# Altium project Sensy_Boi.PrjPcb
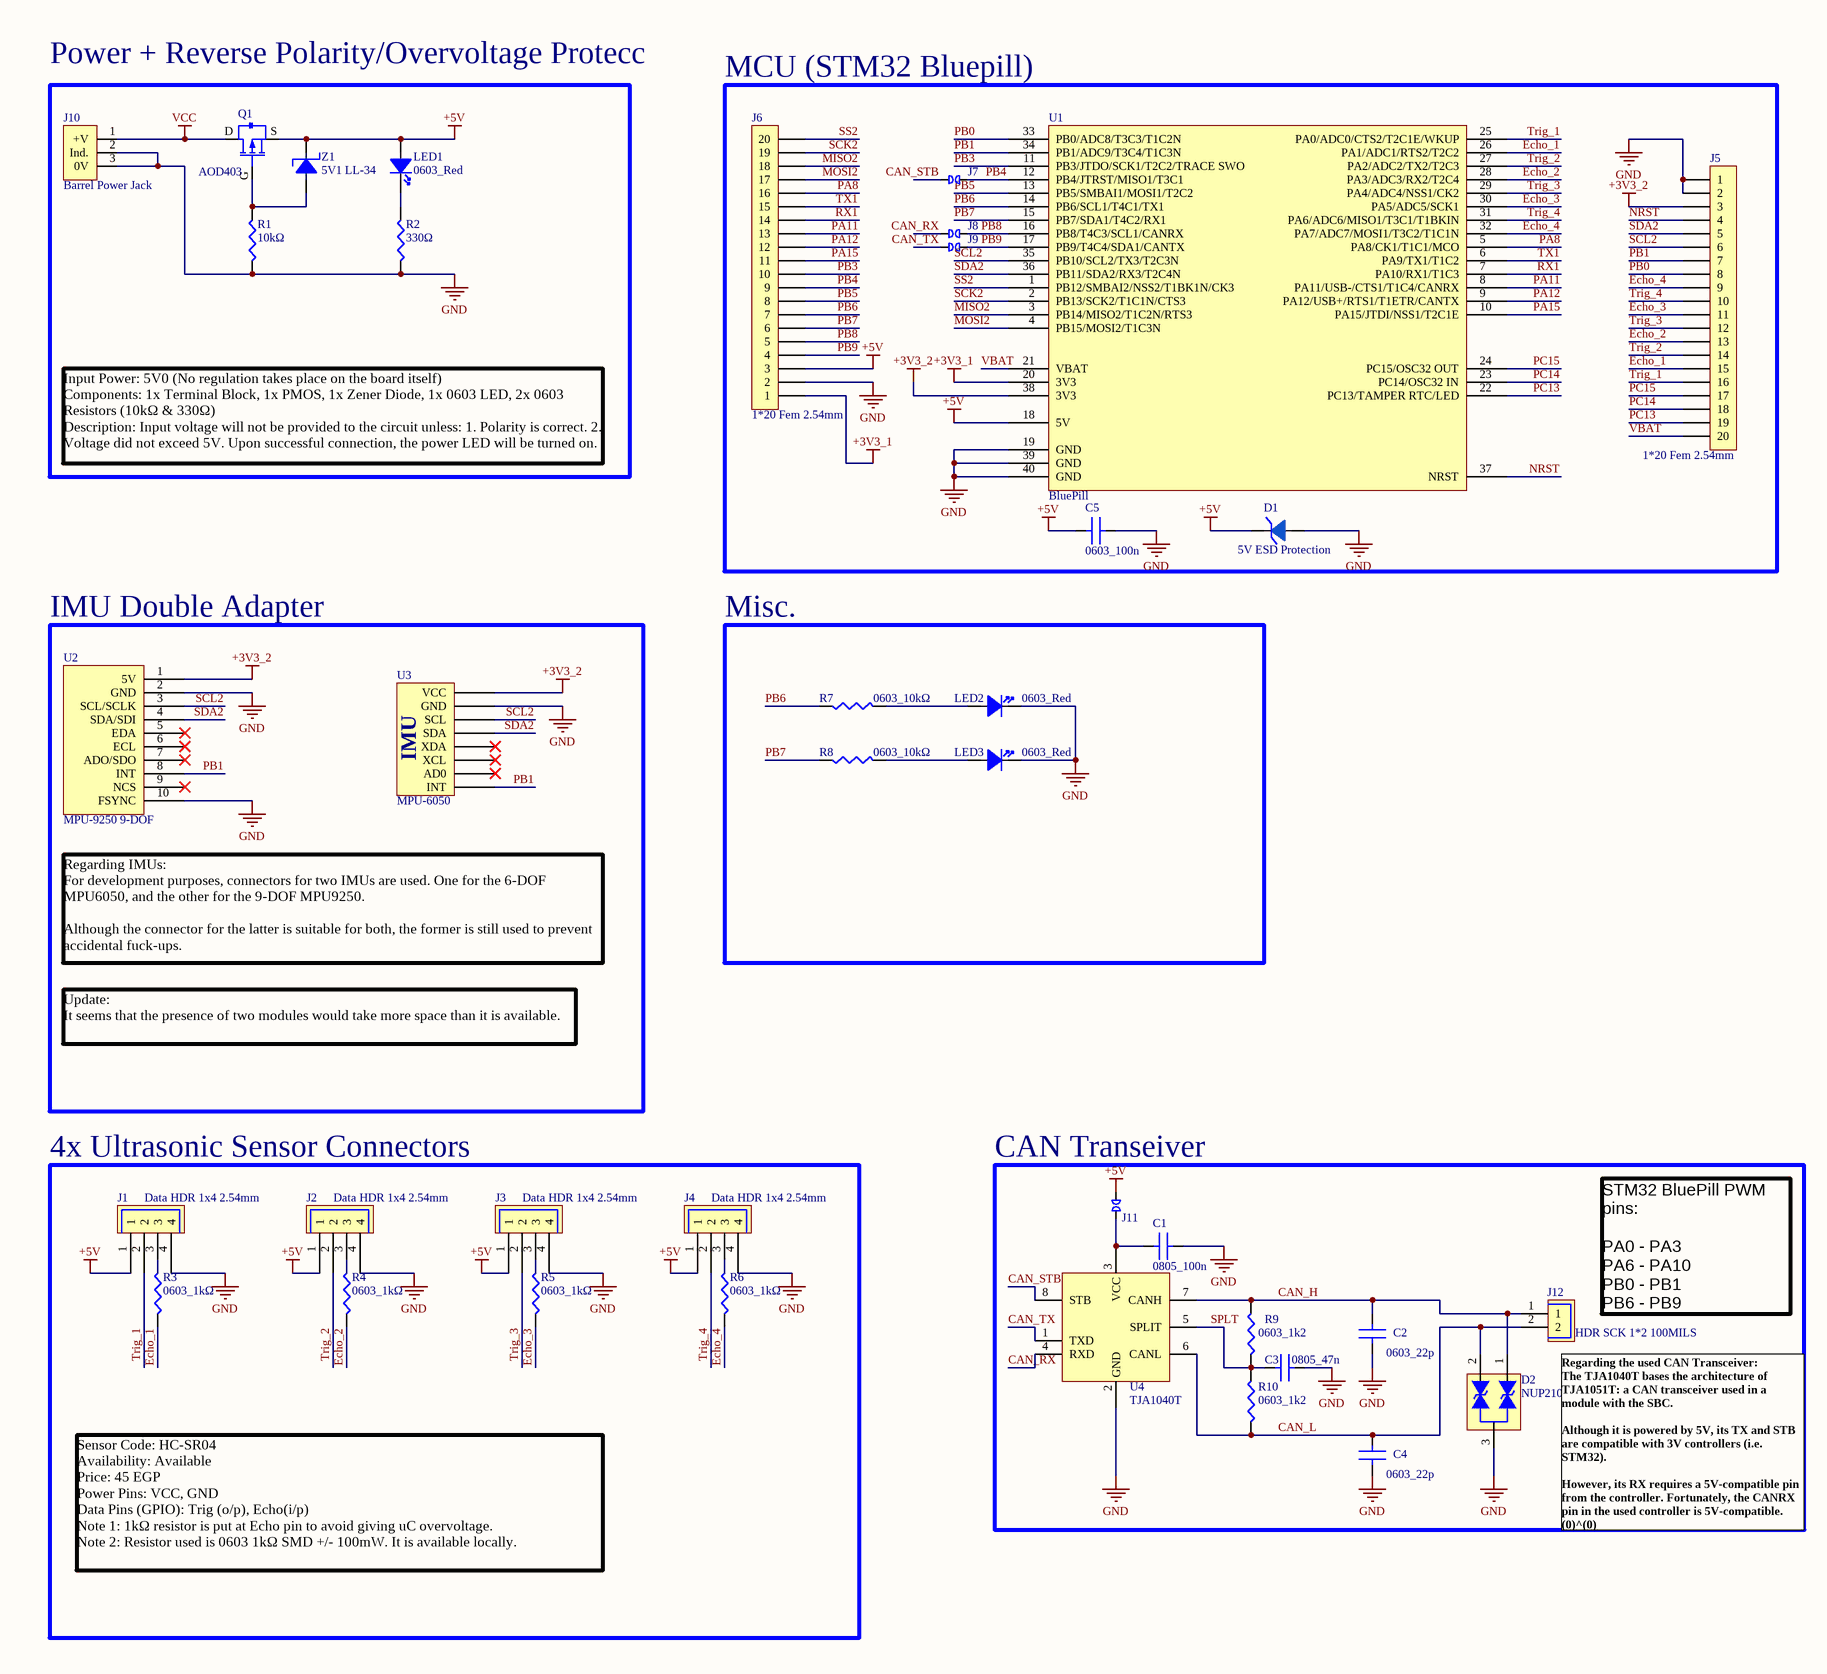
[diagram p0: Sensy_Boi_sch.SchDoc, left]
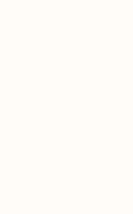
[diagram p1: Sensy_Boi_sch.SchDoc, right]
1 sheet, 38 parts. Net scope: global (net labels, ports and power ports of the same name join across sheets).
Board file: Sensy_Boi_pcb.PcbDoc

## Sheet Sensy_Boi_sch.SchDoc
size C; SheetNumber: 1; SheetTotal: 1

### Parts
C1  0805_100n  [C0805 - 0.1uf]
C2  0603_22p  [0603_CAP]
C3  0805_47n  [C0805 - 0.1uf]
C4  0603_22p  [0603_CAP]
C5  0603_100n  [0603_CAP]
D1  5V ESD Protection  [D0-214AA]
D2  NUP2105L  [SO-23]
J1  Data HDR 1x4 2.54mm  [DHDR_1x4_2.54mm]
J2  Data HDR 1x4 2.54mm  [DHDR_1x4_2.54mm]
J3  Data HDR 1x4 2.54mm  [DHDR_1x4_2.54mm]
J4  Data HDR 1x4 2.54mm  [DHDR_1x4_2.54mm]
J5  1*20 Fem 2.54mm  [20*1 FEM 2.54mm]
J6  1*20 Fem 2.54mm  [20*1 FEM 2.54mm]
J7  Jumper Pads  [JMP]  (value not drawn)
J8  Jumper Pads  [JMP]  (value not drawn)
J9  Jumper Pads  [JMP]  (value not drawn)
J10  Barrel Power Jack  [pwr_Jack]
J11  Jumper Pads  [JMP]  (value not drawn)
J12  HDR SCK 1*2 100MILS  [DHDR 1*2 2,54MM]
LED1  0603_Red  [0603_LED]
LED2  0603_Red  [0603_LED]
LED3  0603_Red  [0603_LED]
Q1  AOD403  [DPAK]
R1  10kΩ  [0603_CAP]
R2  330Ω  [0603_CAP]
R3  0603_1kΩ  [0603_CAP]
R4  0603_1kΩ  [0603_CAP]
R5  0603_1kΩ  [0603_CAP]
R6  0603_1kΩ  [0603_CAP]
R7  0603_10kΩ  [0603_CAP]
R8  0603_10kΩ  [0603_CAP]
R9  0603_1k2  [0603_CAP]
R10  0603_1k2  [0603_CAP]
U1  BluePill  [BluePill]
U2  MPU-9250 9-DOF  [MPU9250]
U3  MPU-6050  [IMU]
U4  TJA1040T  [SOP8 - duplicate]
Z1  5V1 LL-34  [LL-34]

### Blocks framed on the sheet
Power + Reverse Polarity/Overvoltage Protecc: J10 LED1 Q1 R1 R2 Z1
MCU (STM32 Bluepill): C5 D1 J5-J9 U1
IMU Double Adapter: U2 U3
Misc.: LED2 LED3 R7 R8
4x Ultrasonic Sensor Connectors: J1-J4 R3-R6
CAN Transeiver: C1-C4 D2 J11 J12 R9 R10 U4

### Nets
+3V3_1: J6.1 U1.20(3V3)
+3V3_2: J5.3 U1.38(3V3) U2.1(5V) U3.VCC
+5V: C5.1 D1.K(Cathode) J1.1 J2.1 J3.1 J4.1 J6.3 J11.2 LED1.1(Anode) Q1.S U1.18(5V) Z1.K(Cathode)
GND: C1.1 C2.1 C3.1 C4.1 C5.2 D1.A(Anode) D2.3(IN3) J1.4 J2.4 J3.4 J4.4 J5.1 J5.2 J6.2 J10.2(Ind.) J10.3(0V) LED2.2(Cathode) LED3.2(Cathode) R1.1 R2.1 U1.19(GND) U1.39(GND) U1.40(GND) U2.2(GND) U2.10(FSYNC) U3.GND U4.2(GND)
VCC: J10.1(+V) Q1.D
CAN_H: C2.2 D2.1(IN1) J12.1 R9.2 U4.7(CANH)
CAN_L: C4.2 D2.2(IN2) J12.2 R10.1 U4.6(CANL)
CAN_RX: J8.1 U4.4(RXD)
CAN_STB: J7.1 U4.8(STB)
CAN_TX: J9.1 U4.1(TXD)
Echo_1: J5.15 R3.1 U1.26(PA1/ADC1/RTS2/T2C2)
Echo_2: J5.13 R4.1 U1.28(PA3/ADC3/RX2/T2C4)
Echo_3: J5.11 R5.1 U1.30(PA5/ADC5/SCK1)
Echo_4: J5.9 R6.1 U1.32(PA7/ADC7/MOSI1/T3C2/T1C1N)
MISO2: J6.18 U1.3(PB14/MISO2/T1C2N/RTS3)
MOSI2: J6.17 U1.4(PB15/MOSI2/T1C3N)
NRST: J5.4 U1.37(NRST)
PA8: J6.16 U1.5(PA8/CK1/T1C1/MCO)
PA11: J6.13 U1.8(PA11/USB-/CTS1/T1C4/CANRX)
PA12: J6.12 U1.9(PA12/USB+/RTS1/T1ETR/CANTX)
PA15: J6.11 U1.10(PA15/JTDI/NSS1/T2C1E)
PB0: J5.8 U1.33(PB0/ADC8/T3C3/T1C2N)
PB1: J5.7 U1.34(PB1/ADC9/T3C4/T1C3N) U2.8(INT) U3.INT
PB3: J6.10 U1.11(PB3/JTDO/SCK1/T2C2/TRACE_SWO)
PB4: J6.9 J7.2 U1.12(PB4/JTRST/MISO1/T3C1)
PB5: J6.8 U1.13(PB5/SMBAI1/MOSI1/T2C2)
PB6: J6.7 R7.2 U1.14(PB6/SCL1/T4C1/TX1)
PB7: J6.6 R8.2 U1.15(PB7/SDA1/T4C2/RX1)
PB8: J6.5 J8.2 U1.16(PB8/T4C3/SCL1/CANRX)
PB9: J6.4 J9.2 U1.17(PB9/T4C4/SDA1/CANTX)
PC13: J5.19 U1.22(PC13/TAMPER_RTC/LED)
PC14: J5.18 U1.23(PC14/OSC32_IN)
PC15: J5.17 U1.24(PC15/OSC32_OUT)
RX1: J6.14 U1.7(PA10/RX1/T1C3)
SCK2: J6.19 U1.2(PB13/SCK2/T1C1N/CTS3)
SCL2: J5.6 U1.35(PB10/SCL2/TX3/T2C3N) U2.3(SCL/SCLK) U3.SCL
SDA2: J5.5 U1.36(PB11/SDA2/RX3/T2C4N) U2.4(SDA/SDI) U3.SDA
SPLT: C3.2 R9.1 R10.2 U4.5(SPLIT)
SS2: J6.20 U1.1(PB12/SMBAI2/NSS2/T1BK1N/CK3)
Trig_1: J1.2 J5.16 U1.25(PA0/ADC0/CTS2/T2C1E/WKUP)
Trig_2: J2.2 J5.14 U1.27(PA2/ADC2/TX2/T2C3)
Trig_3: J3.2 J5.12 U1.29(PA4/ADC4/NSS1/CK2)
Trig_4: J4.2 J5.10 U1.31(PA6/ADC6/MISO1/T3C1/T1BKIN)
TX1: J6.15 U1.6(PA9/TX1/T1C2)
VBAT: J5.20 U1.21(VBAT)
NetC1_2: C1.2 J11.1 U4.3(VCC)
NetJ1_3: J1.3 R3.2
NetJ2_3: J2.3 R4.2
NetJ3_3: J3.3 R5.2
NetJ4_3: J4.3 R6.2
NetLED1_2: LED1.2(Cathode) R2.2
NetLED2_1: LED2.1(Anode) R7.1
NetLED3_1: LED3.1(Anode) R8.1
NetQ1_G: Q1.G R1.2 Z1.A(Anode)

Not connected (* = marked no-connect by the designer): U2 5(EDA)* 6(ECL)* 7(ADO/SDO)* 9(NCS)*; U3 AD0* XCL* XDA*

### Notes on the sheet
- Input Power: 5V0 (No regulation takes place on the board itself)
  Components: 1x Terminal Block, 1x PMOS, 1x Zener Diode, 1x 0603 LED, 2x 0603 Resistors (10kΩ & 330Ω)
  Description: Input voltage will not be provided to the circuit unless: 1. Polarity is correct. 2. Voltage did not exceed 5V. Upon successful connection, the power LED will be turned on.
- Regarding IMUs:
  For development purposes, connectors for two IMUs are used. One for the 6-DOF MPU6050, and the other for the 9-DOF MPU9250.
  Although the connector for the latter is suitable for both, the former is still used to prevent accidental fuck-ups.
- Update:
  It seems that the presence of two modules would take more space than it is available.
- STM32 BluePill PWM pins:
  PA0 - PA3
  PA6 - PA10
  PB0 - PB1
  PB6 - PB9
- (near J12) Regarding the used CAN Transceiver:
  The TJA1040T bases the architecture of TJA1051T: a CAN transceiver used in a module with the SBC.
  Although it is powered by 5V, its TX and STB are compatible with 3V controllers (i.e. STM32).
  However, its RX requires a 5V-compatible pin from the controller. Fortunately, the CANRX pin in the used controller is 5V-compatible.
  (0)^(0)
- Sensor Code: HC-SR04
  Availability: Available
  Price: 45 EGP
  Power Pins: VCC, GND
  Data Pins (GPIO): Trig (o/p), Echo(i/p)
  Note 1: 1kΩ resistor is put at Echo pin to avoid giving uC overvoltage.
  Note 2: Resistor used is 0603 1kΩ SMD +/- 100mW. It is available locally.
- (in symbol MPU-6050 IMU) IMU

### Library data of the parts
C1 C3 = C2012X5R1E105K125AA: TDK - C2012X5R1E105K125AA - SMD Multilayer Ceramic Capacitor, 1 µF, 25 V, 0805 [2012 Metric], ± 10%, X5R, C Series; Capacitance: 1uF; Voltage Rating: 25V; Parameter Name 1: Tape and Reel; Supplier 1: Digi-Key; Manufacturer 1: TDK; Manufacturer Part Number 1: C2012X5R1E105K125AA; Stock 1: 16168; Pricing 1: 1=0.23000, 10=0.15800, 50=0.09500, 100=0.08030, 500=0.05492, 1000=0.04858 (USD); RoHS: Yes; Mount: Surface Mount; Case/Package: 0805; Number of Pins: 2; Weight: 0.000194oz; Case Code (Metric): 2012; Case Code (Imperial): 0805; Dielectric Material: Ceramic; Min Operating Temperature: -55°C; Max Operating Temperature: 85°C; Voltage Rating (DC): 25V; Termination: SMD/SMT; Dielectric: X5R; Tolerance: 10%; Package Quantity: 2000; Resistor Type: Ceramic; Voltage: 25V; Length: 2mm; Height: 1.25mm; Depth: 1.25mm; Width: 0.049inch; Thickness: 0.057inch; Radiation Hardening: No; Lead Free: Lead Free; REACH SVHC: No SVHC; ComponentLink1URL: https://datasheet.ciiva.com/11787/0900766b80c1bb00-11787608.pdf?src-supplier=RSComponents; ComponentLink1Description: https://datasheet.ciiva.com/11787/0900766b80c1bb00-11787608.pdf?src-supplier=RSComponents; ComponentLink2URL: https://datasheet.ciiva.com/16449/e412-c-16449595.pdf?src-supplier=Future+Electronics; ComponentLink2Description: https://datasheet.ciiva.com/16449/e412-c-16449595.pdf?src-supplier=Future+Electronics; ComponentLink3URL: https://datasheet.ciiva.com/28602/1744655-28602171.pdf?src-supplier=Element14; ComponentLink3Description: https://datasheet.ciiva.com/28602/1744655-28602171.pdf?src-supplier=Element14; ComponentLink4URL: https://datasheet.ciiva.com/15192/getdatasheetpartid-726707-15192140.pdf?src-supplier=Verical; ComponentLink4Description: https://datasheet.ciiva.com/15192/getdatasheetpartid-726707-15192140.pdf?src-supplier=Verical; Supplier Part Number 1: 445-1419-1-ND
C2 C4 C5 = 0603 Capacitor
D1 = SMBJ5.0A
D2 = NUP2105L: ESD Protection Dual Diode for CAN Bus Line Protection
J1-J4 = 4-Pin Data Connector: MTA-100 Series, 2.54mm Pitch 4 Way 1 RowStraight PCB Header, Solder Term, 5A; Manufacturer 1: TE Connectivity; Manufacturer Part Number 1: 2-644861-4; Underplate Material: Nickel; Number of Contacts: 4; Connector Type: Plug,Header,Pin; Voltage Rating: 250V; Gender: Male; Shrouded: Yes (With); PCB Mount Retention: Without; PCB Mounting Orientation: Vertical; Contact Resistance: 6mR; Backwall/Post Interruptions: No (Without); Connector System: Wire-to-Board; Contact Post Length: 3.56mm; Plating Thickness: 6.35um; PCB Thickness: 0.063inch; Approvals: CSA; Supplier 1: Digi-Key; Stock 1: 18767; Pricing 1: 1=0.79000, 10=0.74100, 100=0.56790, 500=0.49380, 1000=0.40739, 5000=0.35801, 10000=0.33332 (USD); RoHS: Yes; Mount: Through Hole; Housing Color: Black; Color: Black; Contact Material: Copper Alloy; Contact Plating: Tin,Matte; Housing Material: Polyester; Contact Shape: Square; Min Operating Temperature: -67°C; Max Operating Temperature: 221°C; Termination: Solder; Number of Rows: 1; Contact Gender: Male; Number of Positions: 4; Package Quantity: 500; Packaging: Loose Piece; Current Rating: 5A; Voltage Rating (AC): 250V; Mating Alignment: Yes (With); Orientation: Straight; Fastening Type: Friction; Max Voltage Rating (AC): 250V; Contact Current Rating: 5A; Contact Retention: No (Without); Mating Retention: Yes (With); PCB Mount Alignment: No (Without); Sealable: No (Without); Strain Relief: No (Without); Contact Style: Straight; Length: 12.29mm; Height: 10.41mm; Pitch: 2.54mm; Contact Mating Length: 5.1mm; Depth: 7.95mm; Tail Length: 3.56mm; Radiation Hardening: No; Flammability Rating: UL94 V-0; ELV: Compliant; Lead Free: Lead Free; REACH SVHC: Unknown; ComponentLink1URL: https://datasheet.ciiva.com/7800/1651878-7800290.pdf?src-supplier=Element14; ComponentLink1Description: https://datasheet.ciiva.com/7800/1651878-7800290.pdf?src-supplier=Element14; ComponentLink2URL: https://datasheet.ciiva.com/15175/getdatasheetpartid-36841-15175492.pdf?src-supplier=Verical; ComponentLink2Description: https://datasheet.ciiva.com/15175/getdatasheetpartid-36841-15175492.pdf?src-supplier=Verical; ComponentLink3URL: https://datasheet.ciiva.com/11759/0900766b80f915a0-11759930.pdf?src-supplier=RSComponents; ComponentLink3Description: https://datasheet.ciiva.com/11759/0900766b80f915a0-11759930.pdf?src-supplier=RSComponents; ComponentLink4URL: https://datasheet.ciiva.com/714/eng-cd-644861-n-basefilename-714593.pdf?src-supplier=Digi-Key; ComponentLink4Description: https://datasheet.ciiva.com/714/eng-cd-644861-n-basefilename-714593.pdf?src-supplier=Digi-Key; ComponentLink5URL: https://datasheet.ciiva.com/16684/eng-ds-82056-mta-0608-16684709.pdf?src-supplier=Avnet+Europe; ComponentLink5Description: https://datasheet.ciiva.com/16684/eng-ds-82056-mta-0608-16684709.pdf?src-supplier=Avnet+Europe; ComponentLink6URL: https://datasheet.ciiva.com/16497/eng-ds-82056-mta-0608-16497871.pdf?src-supplier=Avnet+Asia; ComponentLink6Description: https://datasheet.ciiva.com/16497/eng-ds-82056-mta-0608-16497871.pdf?src-supplier=Avnet+Asia; Supplier Part Number 1: A30933-ND
J10 = Con-Jack: DC-Power Socket 12V 5A 2, 1mm Solder Eyel; Manufacturer 1: Cliff; Manufacturer Part Number 1: FC68148; Parameter Name 1: Bulk; Inside Diameter: 6.3mm; Supplier 1: Conrad; RoHS: Yes; Weight: 0.1lb; Current Rating: 5A; Orientation: Right Angle; Connector Type: Socket; Length: 5inch; Height: 0.25inch; Width: 3inch; ComponentLink1URL: http://www.farnell.com/datasheets/317160.pdf?src-supplier=Farnell; ComponentLink1Description: http://www.farnell.com/datasheets/317160.pdf?src-supplier=Farnell; ComponentLink2URL: http://www.rapidonline.com/pdf/735742_da_en_01.pdf?src-supplier=Rapid+Electronics; ComponentLink2Description: http://www.rapidonline.com/pdf/735742_da_en_01.pdf?src-supplier=Rapid+Electronics; ComponentLink3URL: http://www.produktinfo.conrad.com/datenblaetter/725000-749999/735742-da-01-en-DC_BUCHSE_2_1MM_FC68148.pdf?src-supplier=Conrad; ComponentLink3Description: http://www.produktinfo.conrad.com/datenblaetter/725000-749999/735742-da-01-en-DC_BUCHSE_2_1MM_FC68148.pdf?src-supplier=Conrad; Supplier Part Number 1: 735742
J12 = 2-Pin Data Connector: Conn Shrouded Header HDR 2 POS 2.54mm Solder ST Thru-Hole; Manufacturer 1: TE Connectivity; Manufacturer Part Number 1: 2-644861-2; Underplate Material: Nickel; Number of Contacts: 2; Connector Type: Plug,Header,Pin; Voltage Rating: 250V; Mating Alignment: Yes (With); PCB Mount Retention: Without; PCB Mounting Orientation: Vertical; Gender: Male; Current Rating: 5A; Contact Resistance: 6mR; Contact Retention: No (Without); Connector System: Wire-to-Board; Contact Style: Straight; Contact Post Length: 3.56mm; Plating Thickness: 6.3um; PCB Thickness: 0.063inch; Approvals: CSA; Supplier 1: Digi-Key; Stock 1: 3206; Pricing 1: 1=0.41000, 10=0.39200, 100=0.27420, 500=0.23506, 1000=0.19588, 5000=0.16790, 10000=0.15670 (USD); RoHS: Yes; Mount: Through Hole; Housing Color: Black; Contact Plating: Tin,Matte; Contact Material: Copper Alloy; Housing Material: Polyester; Color: Black; Contact Shape: Square; Min Operating Temperature: -67°C; Max Operating Temperature: 221°C; Termination: Solder; Number of Rows: 1; Number of Positions: 2; Package Quantity: 500; Packaging: Bag; Contact Gender: Male; Orientation: Straight; Fastening Type: Friction; Max Voltage Rating (AC): 250V; Shrouded: Yes (With); Voltage Rating (AC): 250V; Mating Retention: Yes (With); PCB Mount Alignment: No (Without); Sealable: No (Without); Contact Current Rating: 5A; Strain Relief: No (Without); Backwall/Post Interruptions: No (Without); Length: 7.21mm; Height: 10.41mm; Pitch: 2.54mm; Contact Mating Length: 5.1mm; Depth: 7.95mm; Tail Length: 3.56mm; Radiation Hardening: No; Flammability Rating: UL94 V-0; ELV: Compliant; Lead Free: Lead Free; REACH SVHC: Unknown; ComponentLink1URL: https://datasheet.ciiva.com/16303/eng-ds-82056-mta-0608-16303634.pdf?src-supplier=Future+Electronics; ComponentLink1Description: https://datasheet.ciiva.com/16303/eng-ds-82056-mta-0608-16303634.pdf?src-supplier=Future+Electronics; ComponentLink2URL: https://datasheet.ciiva.com/30111/8852eng-ds-82056-mta-0608-30111398.pdf?src-supplier=Onlinecomponents.com; ComponentLink2Description: https://datasheet.ciiva.com/30111/8852eng-ds-82056-mta-0608-30111398.pdf?src-supplier=Onlinecomponents.com; ComponentLink3URL: https://datasheet.ciiva.com/709/eng-cd-644861-n-basefilename-709739.pdf?src-supplier=Digi-Key; ComponentLink3Description: https://datasheet.ciiva.com/709/eng-cd-644861-n-basefilename-709739.pdf?src-supplier=Digi-Key; ComponentLink4URL: https://datasheet.ciiva.com/3118/eng-ds-82056-mta-0608-3118126.pdf?src-supplier=Avnet; ComponentLink4Description: https://datasheet.ciiva.com/3118/eng-ds-82056-mta-0608-3118126.pdf?src-supplier=Avnet; Supplier Part Number 1: A30931-ND
LED1-LED3 = 0603LED
Q1 = AOD403: MOSFET Transistor P-Channel 30V 15A 3.5V @ 250uA 6mΩ @ 20A,20V 2.5W TO-252-2(DPAK)
R1 R2 R7-R10 = 0603 Resistor
R3-R6 = 0603 Resistor: 1k +/- 1 100mW
U1 = STM32 BluePill
U2 = MPU-9250 IMU
U3 = MPU-6050 IMU
U4 = TJA1040T: CAN Transceiver
Z1 = Zener 5V1 LL-34